# EAGLE design uSD_extender_female (EAGLE 9.2.1)
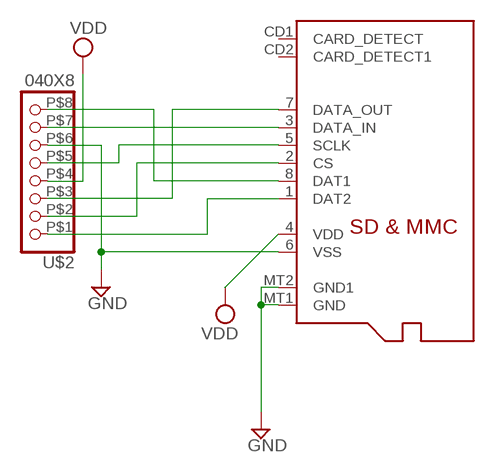
[diagram p0: schematic, sheet 1]

## Parts
U$1  DEAN_MICROSD  [DEAN_MICROSD]
U$2  040X8  [040X8]

## Nets
GND: U$1.MT1(GND) U$1.MT2(GND1)
N$1: U$1.5(SCLK) U$2.P$5
N$2: U$1.2(CS) U$2.P$2
N$3: U$1.1(DAT2) U$2.P$1
N$4: U$1.8(DAT1) U$2.P$8
N$5: U$1.7(DATA_OUT) U$2.P$7
N$6: U$1.3(DATA_IN) U$2.P$3
VDD: U$1.4(VDD) U$2.P$4
VSS: U$1.6(VSS) U$2.P$6 ; supply symbol labelled GND
Unconnected: U$1.CD1(CARD_DETECT) U$1.CD2(CARD_DETECT1)

## Library data of the parts
U$1 = uSD_extender_female:DEAN_MICROSD: Micro-SD / Transflash card holder with SPI pinout For the 3M # 2908-05WB-MG and/or 4UCON #19656 push-push type
U$2 = Dean:040X8

## Board
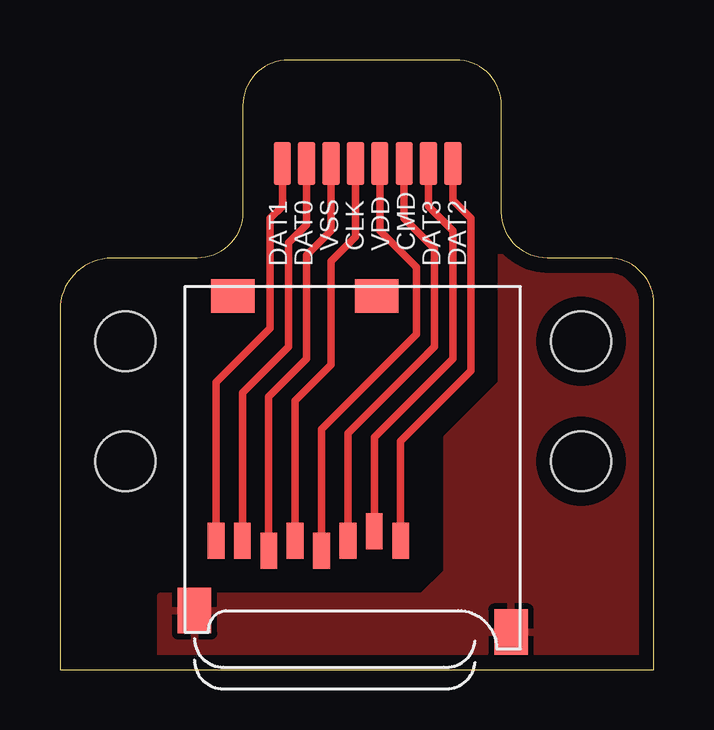
[diagram p1: board, top side]

Size 24.77 x 25.4 mm. Coordinates in mm from the lower left corner, seen from the top.
Outline: 0,14.98 0,0 24.77,0 24.77,15.24 arc90 22.86,17.14 20.32,17.14 arc-90 18.41,19.05 18.41,23.5 arc90 16.51,25.4 9.53,25.4 arc90 7.62,23.5 7.62,19.05 arc-90 5.71,17.14 2.17,17.14 arc90 0,14.98
Copper layers (1*16): Top 0.035mm / dielectric 1.5mm / Bottom 0.035mm
Design rules "default *": minimum track width 10mil, minimum drill 13mil, track to track 8mil, track to pad 8mil, pad to pad 8mil, via to via 8mil, smd to smd 8mil, copper to edge 24mil, drill to drill 8mil, minimum pad ring 10mil, minimum via ring 8mil, stop-mask expansion 2mil, vias tented up to drill 20mil, thermal gap 10mil
Holes 2.5 mm at 2.73,13.68 2.73,8.68 21.73,13.68 21.73,8.68

### Footprints (pad centres in the part's own frame; a part is rotated, then mirrored left to right if it is on the bottom)
DEAN_MICROSD = smd 0.7 x 1.5: 1 9,-10.64; 2 7.9,-10.24; 3 6.8,-10.64; 4 5.7,-11.04; 5 4.6,-10.64; 6 3.5,-11.04; 7 2.4,-10.64; 8 1.3,-10.64 | smd 1.8 x 1.4: CD1 2,-0.44; CD2 8,-0.44 | smd 1.4 x 1.9: MT1 0.4,-13.54; MT2 13.6,-14.44
040X8 = smd 0.711 x 1.778: P$1 0,0; P$2 1.016,0; P$3 2.032,0; P$4 3.048,0; P$5 4.064,0; P$6 5.08,0; P$7 6.096,0; P$8 7.112,0

### Placement (x,y rotation side)
U$1  5.21,16 0 top
U$2  16.38,21.08 180 top

### Tracks (layer width: path | path; a pad name or v marks a point on that pad's centre or on a via)
GND
  pour Top: 4.19,3.05 15.11,3.05 16.13,4.06 16.13,9.65 18.41,11.94 18.41,23.37 25.78,16 25.78,-0.25 4.45,-0.25 4.19,0
N$1
  Top 0.305: U$1.5 9.81,11.2 11.3,12.7 11.3,17.02 12.32,18.03 U$2.P$5
N$2
  Top 0.305: U$1.2 13.11,9.68 16.38,12.95 16.38,18.29 15.37,19.3 U$2.P$2
N$3
  Top 0.305: U$1.1 14.21,9.51 17.14,12.45 17.14,18.8 16.38,19.56 U$2.P$1
N$4
  Top 0.305: U$1.8 6.51,11.97 8.76,14.22 8.76,18.8 9.27,19.3 U$2.P$8
N$5
  Top 0.305: U$1.7 7.61,11.54 9.53,13.46 9.53,17.78 10.29,18.54 U$2.P$7
N$6
  Top 0.305: U$1.3 12.01,9.85 15.62,13.46 15.62,17.53 14.35,18.8 U$2.P$3
VDD
  Top 0.305: U$1.4 10.91,10.02 14.86,13.97 14.86,16.76 13.34,18.29 U$2.P$4
VSS
  Top 0.305: U$1.6 8.71,11.37 10.29,12.95 10.29,17.27 11.3,18.29 U$2.P$6

### Text on the board
tNames: DAT1 | DAT0 | VSS | CLK | VDD | CMD | DAT3 | DAT2